# EAGLE design FT231X (EAGLE 6.1)
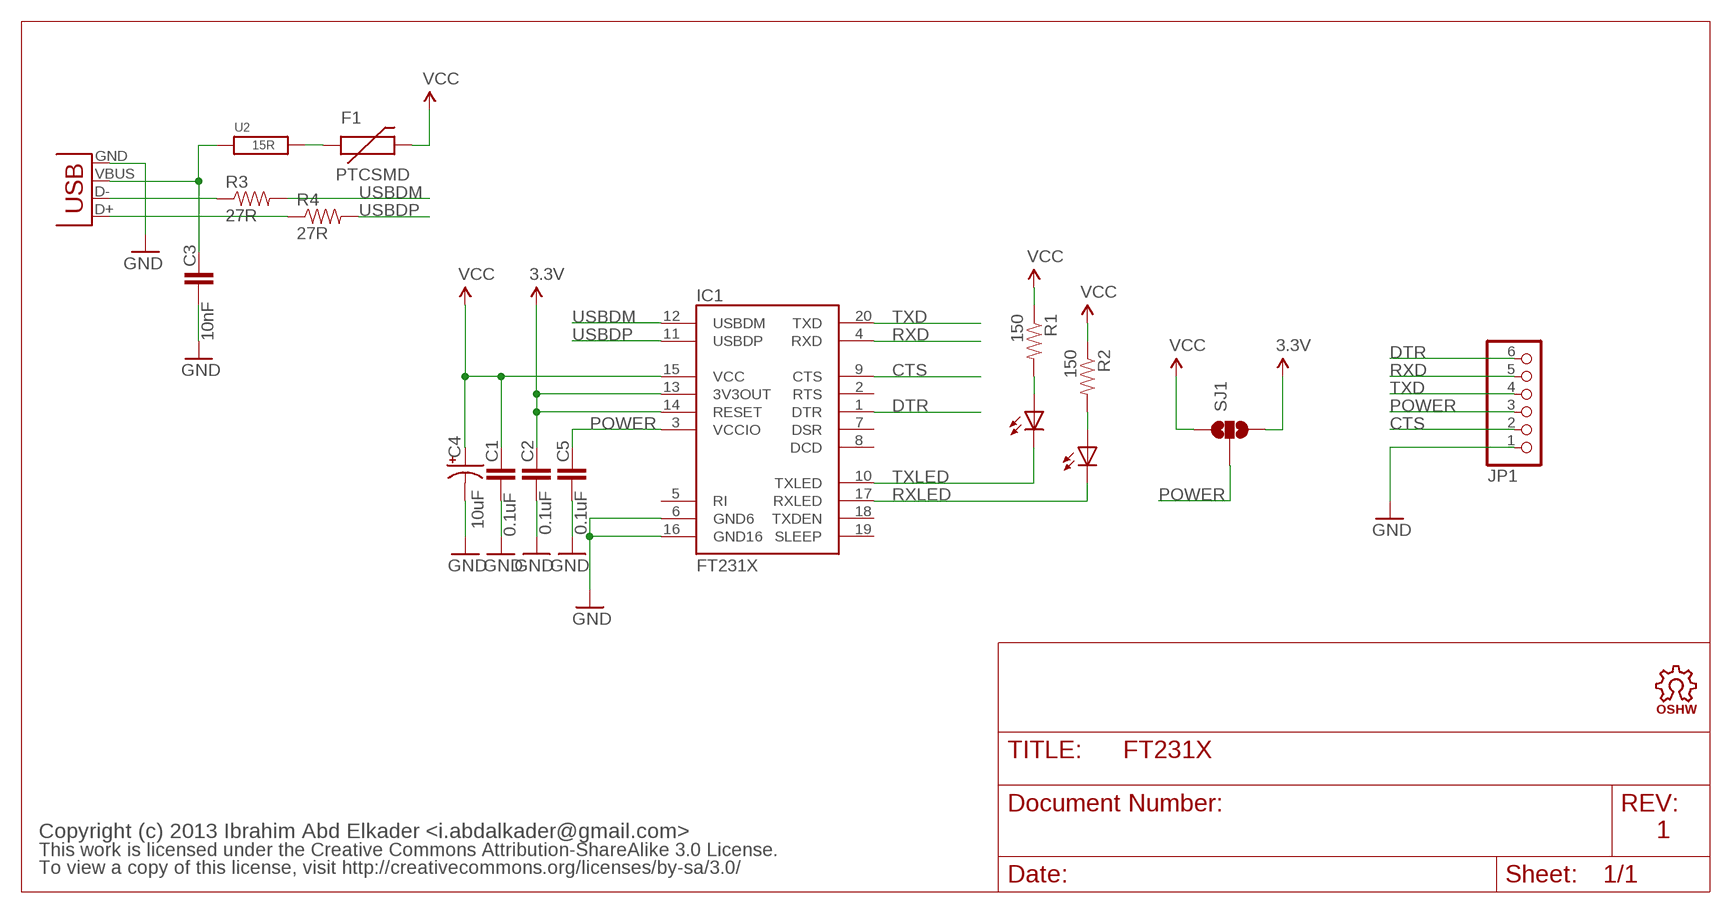
[diagram p0: schematic, sheet 1]

## Parts
C1  0.1uF  CAP0402-CAP  [0402-CAP]
C2  0.1uF  CAP0402-CAP  [0402-CAP]
C3  10nF  CAP0402-CAP  [0402-CAP]
C4  10uF  CAP_POL1206  [EIA3216]
C5  0.1uF  CAP0402-CAP  [0402-CAP]
D1  LED0603  [LED-0603]
D2  LED0603  [LED-0603]
F1  PTCSMD  [PTC-1206]
IC1  FT231X  [SSOP20]
JP1  PINHD-1X6  [1X06]
LOGO1  OSHW_LOGO_FILLX0100-NT  [OSHW_FILLX100_NOTEXT]
R1  150  RESISTOR0402-RES  [0402-RES]
R2  150  RESISTOR0402-RES  [0402-RES]
R3  27R  RESISTOR0402-RES  [0402-RES]
R4  27R  RESISTOR0402-RES  [0402-RES]
SJ1  SOLDERJUMPER_2WAYS  [SJ_3]
U2  15R  BEAD  [0402-CAP]
X1  USBSMD  [USB-MINIB]

## Nets
3.3V: C2.1 IC1.13(3V3OUT) IC1.14(RESET) SJ1.3
CTS: IC1.9(CTS) JP1.2
DTR: IC1.1(DTR) JP1.6
GND: C1.2 C2.2 C3.2 C4.C(-) C5.2 IC1.6(GND6) IC1.16(GND16) JP1.1 X1.GND
N$1: D2.A R1.2
N$3: R3.1 X1.D-
N$4: R4.1 X1.D+
N$5: F1.1 U2.2
N$17: D1.A R2.2
POWER: C5.1 IC1.3(VCCIO) JP1.3 SJ1.2
RXD: IC1.4(RXD) JP1.5
RXLED: D1.C IC1.17(RXLED)
TXD: IC1.20(TXD) JP1.4
TXLED: D2.C IC1.10(TXLED)
USBDM: IC1.12(USBDM) R3.2
USBDP: IC1.11(USBDP) R4.2
VBUS: C3.1 U2.1 X1.VBUS
VCC: C1.1 C4.A(+) F1.2 IC1.15(VCC) R1.1 R2.1 SJ1.1
Unconnected: IC1.2(RTS) IC1.5(RI) IC1.7(DSR) IC1.8(DCD) IC1.18(TXDEN) IC1.19(SLEEP)

## Notes on the sheet
- Copyright (c) 2013 Ibrahim Abd Elkader <i.abdalkader@gmail.com> | 1
- This work is licensed under the Creative Commons Attribution-ShareAlike 3.0 License.
- To view a copy of this license, visit http://creativecommons.org/licenses/by-sa/3.0/

## Library data of the parts
C1-C3 C5 = sfe:CAP: Capacitor Standard 0603 ceramic capacitor, and 0.1" leaded capacitor.
C4 = sfe:CAP_POL: Capacitor Polarized These are standard SMD and PTH capacitors. Normally 10uF, 47uF, and 100uF in electrolytic and tantalum varieties. Always verify the external diameter of the through hole cap, it varies with capacity, voltage, and manufacturer. The EIA devices should be standard.
D1 D2 = sfe:LED: LEDs Standard schematic elements and footprints for 5mm, 3mm, 1206, and 0603 sized LEDs. 5mm - Spark Fun Electronics SKU : COM-00529 (and others)
F1 = sfe:PTC: Resettable Fuse PTC Resettable Fuse. Spark Fun Electronics SKU : COM-08357
IC1 = iofault:FT231X: USB UART FT232RL 4th Generation USB UART (USB <-> Serial) Controller. Spark Fun Electronics SKU : COM-00650
JP1 = pinhead:PINHD-1X6: PIN HEADER
LOGO1 = iofault:OSHW_LOGO_FILL
R1-R4 = sfe:RESISTOR: Resistor Basic schematic elements and footprints for 0603, 1206, and PTH resistors.
SJ1 = sfe:SOLDERJUMPER_2WAY: Solder Jumper 2 way solder jumper
U2 = heka:BEAD
X1 = sfe:USB: USB Connectors USB-B-PTH is fully proven SKU : PRT-00139 USB-miniB is fully proven SKU : PRT-00587 USB-A-PCB is untested. USB-A-H is throughly reviewed, but untested. Spark Fun Electronics SKU : PRT-00437 USB-B-SMT is throughly reviewed, but untested. Needs silkscreen touching up. USB-A-S has not been used/tested USB-MB-H has not been used/tested

## Board
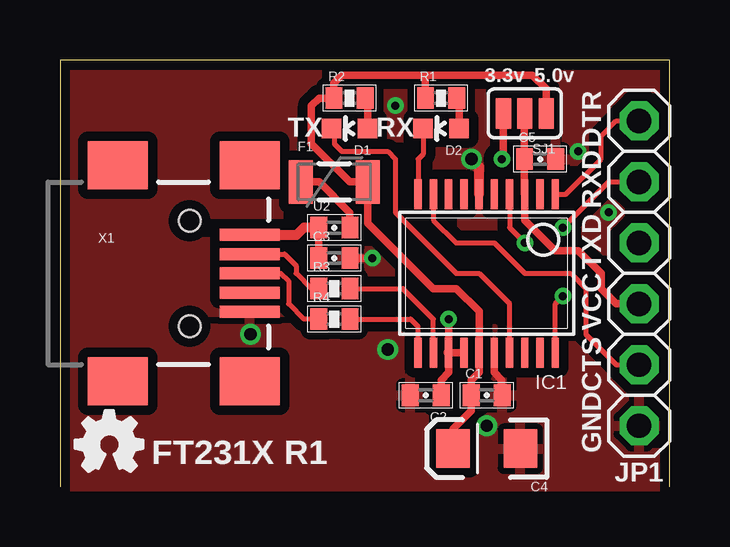
[diagram p1: board, top side]
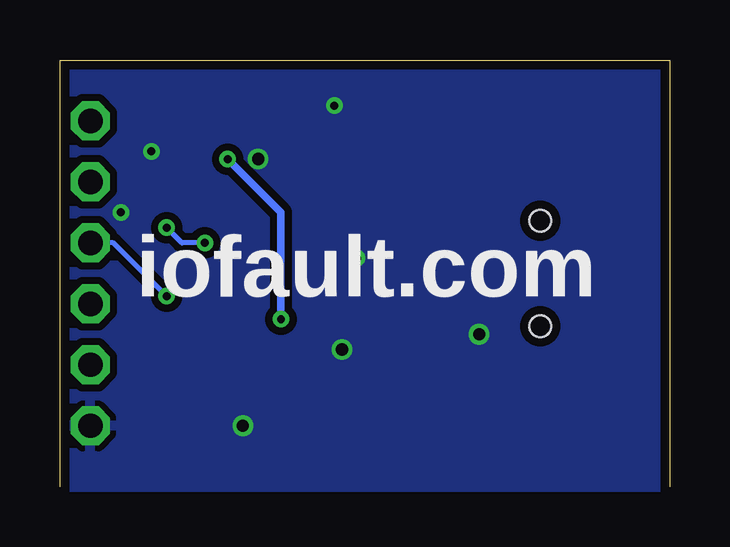
[diagram p2: board, bottom side, seen from below]

Size 25.4 x 17.78 mm. Coordinates in mm from the lower left corner, seen from the top.
Outline: 25.4,0 25.4,17.78 0,17.78 0,0
Copper layers (1*16): Top 0.0356mm / dielectric 1.5011mm / Bottom 0.0356mm
Design rules: minimum track width 6mil, minimum drill 13mil, track to track 6mil, track to pad 6mil, pad to pad 6mil, via to via 6mil, smd to smd 6mil, copper to edge 15mil, drill to drill 6mil, minimum pad ring 12mil, minimum via ring 7mil, stop-mask expansion 2mil, vias tented up to drill 20mil, thermal gap 10mil

### Footprints (pad centres in the part's own frame; a part is rotated, then mirrored left to right if it is on the bottom)
0402-CAP = smd 0.7 x 0.9: 1 -0.65,0; 2 0.65,0
EIA3216 = smd 1.4 x 1.6: A 1.4,0; C -1.4,0
LED-0603 = smd 0.8 x 0.8: A 0,-0.75; C 0,0.75
PTC-1206 = smd 1 x 1.8: 1 -1.4,0; 2 1.4,0
SSOP20 = smd 0.305 x 1.245: 1 -2.857,-3.302; 2 -2.222,-3.302; 3 -1.587,-3.302; 4 -0.952,-3.302; 5 -0.317,-3.302; 6 0.318,-3.302; 7 0.953,-3.302; 8 1.588,-3.302; 9 2.223,-3.302; 10 2.858,-3.302; 11 2.858,3.302; 12 2.223,3.302; 13 1.588,3.302; 14 0.953,3.302; 15 0.318,3.302; 16 -0.317,3.302; 17 -0.952,3.302; 18 -1.587,3.302; 19 -2.222,3.302; 20 -2.857,3.302
1X06 = drill 1.016 octagon: 1 -6.35,0; 2 -3.81,0; 3 -1.27,0; 4 1.27,0; 5 3.81,0; 6 6.35,0
0402-RES = smd 0.7 x 0.9: 1 -0.65,0; 2 0.65,0
SJ_3 = smd 0.635 x 1.27: 1 -0.889,0; 2 0,0; 3 0.889,0
USB-MINIB = smd 2.5 x 0.5: D+ 2.5,0; D- 2.5,0.8; GND 2.5,-1.6; ID 2.5,-0.8; VBUS 2.5,1.6 | smd 2.5 x 2: MTN1 -3,4.5; MTN2 2.5,4.5; MTN3 -3,-4.5; MTN4 2.5,-4.5 | hole 0.9: 0,2.2; 0,-2.2

### Placement (x,y rotation side)
C1  17.78,3.81 0 top
C2  15.24,3.81 180 top
C3  11.43,9.53 0 top
C4  17.78,1.59 180 top
C5  20,13.65 0 top
D1  12.06,14.92 90 top
D2  15.88,14.92 90 top
F1  11.43,12.7 0 top
IC1  17.78,8.89 180 top
JP1  24.13,8.89 90 top
LOGO1  0.64,0.64 0 top
R1  15.88,16.19 0 top
R2  12.06,16.19 0 top
R3  11.43,8.26 0 top
R4  11.43,6.99 0 top
SJ1  19.37,15.56 180 top
U2  11.43,10.79 0 top
X1  5.4,8.89 0 top

### Tracks (layer width: path | path; a pad name or v marks a point on that pad's centre or on a via)
3.3V  (via drill 0.33)
  Top 0.305: IC1.14 IC1.13 | 15.88,3.83 15.88,4.45 16.19,4.76 IC1.13 | SJ1.3 18.48,13.72 | v16.19,6.99 IC1.13
  Top 0.406: 15.88,3.83 C2.1 | 18.48,13.72 v18.41,13.65 | IC1.13
  Bottom 0.305: v18.41,13.65 16.19,11.43 v16.19,6.99
CTS
  Top 0.203: IC1.9 15.56,11.11 16.51,10.16 18.1,10.16 19.37,8.89 21.27,8.89 21.91,8.26 21.91,6.35 23.18,5.08 JP1.2
DTR
  Top 0.203: IC1.1 21.08,12.19 22.54,13.65 22.54,14.61 23.18,15.24 JP1.6
GND  (via drill 0.33, 0.51)
  Top 0.305: C3.2 v13.02,9.53 | IC1.16 18.1,4.76 18.41,4.45 18.41,3.83 C1.2
  Top 0.406: IC1.6 17.46,13.34 v17.14,13.65
  other vias: 7.94,6.35 17.78,2.54 13.65,5.71 21.59,13.97 13.97,15.88 22.86,11.43
  pour Bottom (isolate 0.305): 0,0 0,17.67 0,17.67 0,17.78 25.4,17.78 25.4,0
  pour Top (isolate 0.406): 0,0 0,17.67 0,17.67 0,17.78 25.4,17.78 25.4,0
N$1
  Top 0.305: D2.A 16.62,16.09 R1.2
N$3
  Top 0.203: X1.D- 9.36,9.69 9.84,9.21 9.84,8.89 10.48,8.26 R3.1
N$4
  Top 0.203: X1.D+ 9.21,8.89 9.53,8.57 9.53,7.62 10.16,6.99 R4.1
N$5
  Top 0.305: F1.1 10.79,12.7 12.08,11.41 U2.2
N$17
  Top 0.305: D1.A 12.81,16.09 R2.2
POWER
  Top 0.305: JP1.3 23.18,7.62 22.54,8.26 22.54,8.89 21.59,9.84 20.64,9.84 19.37,11.11 IC1.3 19.35,12.21 C5.1 19.35,15.54 SJ1.2
RXD  (via drill 0.33)
  Top 0.203: IC1.4 18.73,10.8 v19.37,10.16 | v20.95,10.79 22.86,12.7 JP1.5
  Bottom 0.203: v19.37,10.16 20.32,10.16 v20.95,10.79
RXLED
  Top 0.203: D1.C 11.11,14.92 11.43,14.61 11.43,14.29 11.75,13.97 13.65,13.97 13.97,13.65 13.97,11.43 16.51,8.89 17.46,8.89 18.73,7.62 IC1.17
TXD  (via drill 0.33)
  Top 0.203: IC1.20 20.64,7.62 v20.95,7.94
  Bottom 0.203: v20.95,7.94 23.18,10.16 JP1.4
TXLED
  Top 0.203: D2.C 15.12,13.86 14.92,13.65 IC1.10
USBDM
  Top 0.203: IC1.12 15.56,6.99 14.29,8.26 R3.2
USBDP
  Top 0.203: IC1.11 14.92,6.67 14.61,6.99 R4.2
VBUS
  Top 0.305: U2.1 C3.1
  Top 0.406: X1.VBUS 9.86,10.49 10.16,10.79 U2.1
VCC
  Top 0.254: 17.14,3.83 C1.1
  Top 0.305: 17.14,3.83 17.14,4.45 17.46,4.76 IC1.15 17.46,7.3 16.51,8.26 15.56,8.26 12.83,10.98 F1.2 12.06,12.7 10.48,14.29 10.48,15.88 10.79,16.19 R2.1 11.41,16.81 11.75,17.14 15.24,17.14 | C4.A 16.38,2.41 17.13,3.16 C1.1 | 15.24,17.14 19.68,17.14 20.26,16.57 SJ1.1 | R1.1 15.22,17.13 15.24,17.14

### Text on the board
tPlace: 3.3v | 5.0v | TX | RX | DTR | RXD | TXD | VCC | CTS | FT231X R1 | GND
bPlace: iofault.com
Notes: Copyright (c) 2013 Ibrahim Abd Elkader <i.abdalkader@gmail.com> | This work is licensed under the Creative Commons Attribution-ShareAlike 3.0 License. | To view a copy of this license, visit http://creativecommons.org/licenses/by-sa/3.0/